# Altium schematic sheet GM-hv.SchDoc
size A
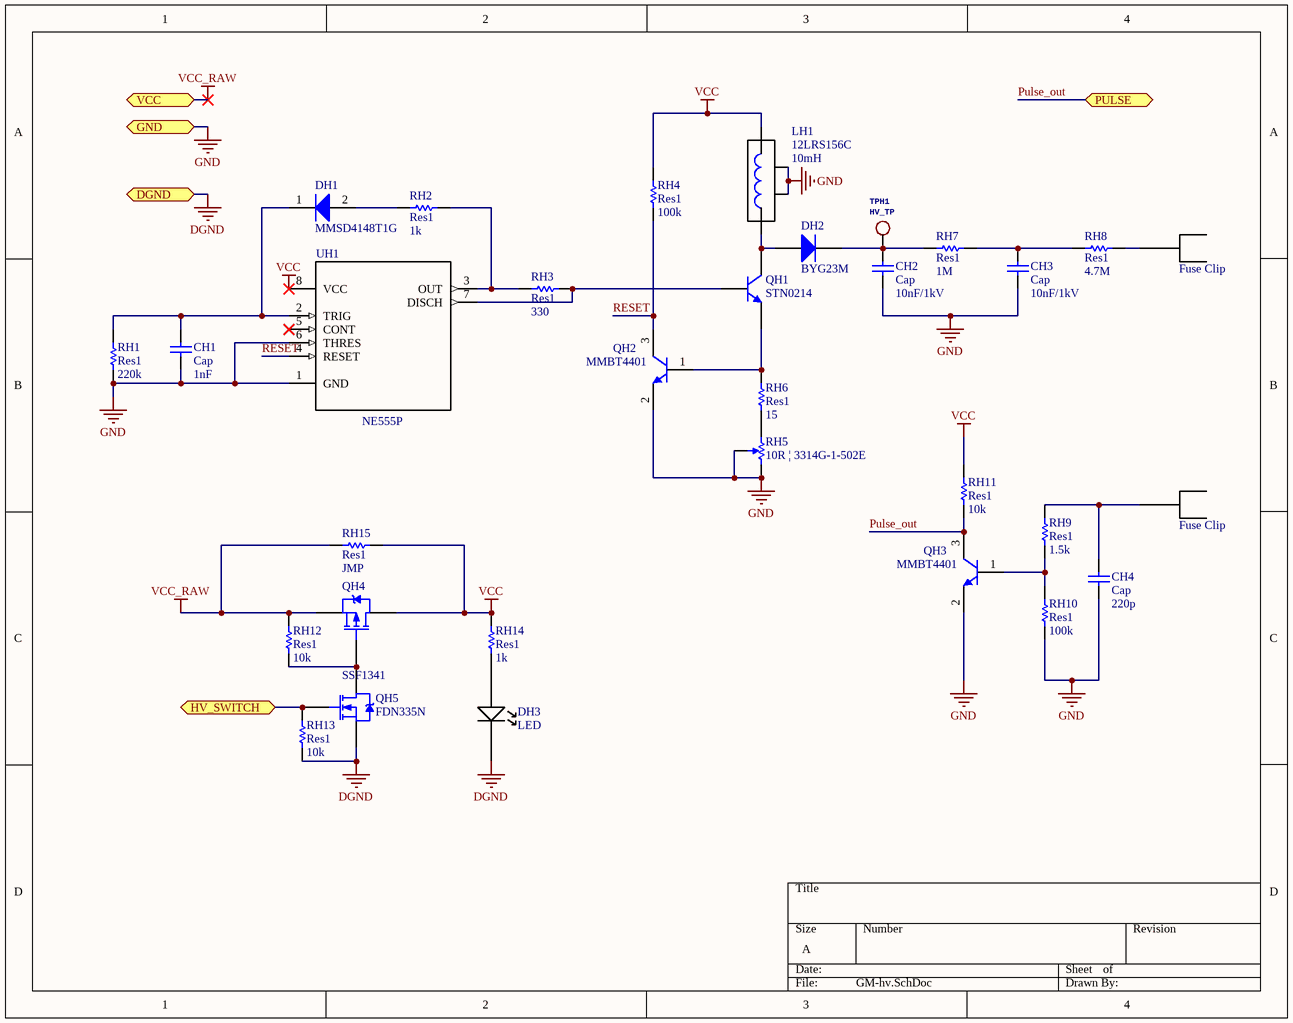
[diagram p0: GM-hv.SchDoc]

## Parts
CH1  Cap  value 1nF  [C 0603 / 1608]
CH2  Cap  value 10nF/1kV  [CAP1206R]
CH3  Cap  value 10nF/1kV  [CAP1206R]
CH4  Cap  value 220p  [C 0603 / 1608]
DH1  MMSD4148T1G  [ONSC-SOD-123-2-425-04_V]
DH2  BYG23M  [DO-214AC]
DH3  LED  [LED 0603]
JH1  Fuse Clip  [FUSE_BK-6003]
JH?  Fuse Clip  [FUSE_BK-6003]
LH1  12LRS156C  value 10mH  [IND_12LRS156C]
QH1  STN0214  [SOT-223-3 - NPN]
QH2  MMBT4401  [ONSC-SOT-23-3-318-08_M]
QH3  MMBT4401  [ONSC-SOT-23-3-318-08_M]
QH4  SSF1341  [SOT23]
QH5  FDN335N  [SOT23]
RH1  Res1  value 220k  [RES0603R]
RH2  Res1  value 1k  [RES0603R]
RH3  Res1  value 330  [RES0603R]
RH4  Res1  value 100k  [RES0603R]
RH5  10R | 3314G-1-502E  [BOUR-3314G-1_V]
RH6  Res1  value 15  [RES0603R]
RH7  Res1  value 1M  [RES0805R]
RH8  Res1  value 4.7M  [RES0805R]
RH9  Res1  value 1.5k  [RES0603R]
RH10  Res1  value 100k  [RES0603R]
RH11  Res1  value 10k  [RES0603R]
RH12  Res1  value 10k  [RES0603R]
RH13  Res1  value 10k  [RES0603R]
RH14  Res1  value 1k  [RES0603R]
RH15  Res1  value JMP  [RES0603R]
TPH1  HV_TP  [TESTPOINT_SMT]
UH1  NE555P  [SOIC-8]

## Ports
DGND (bidir), GND (bidir), HV_SWITCH (bidir), PULSE (bidir), VCC (bidir)

## Nets
DGND: DH3.2(-) QH5.2(S) RH13.1 ; port DGND
GND: CH1.1 CH2.1 CH3.1 CH4.1 LH1.2(GND) LH1.4(GND) QH2.2(E) QH3.2(E) RH1.1 RH5.2 RH5.3 RH10.1 UH1.1(GND) UH1.6(THRES) ; port GND
VCC: LH1.3 QH4.3(D) RH4.2 RH11.2 RH14.2 RH15.1 UH1.8(VCC)
VCC_RAW: QH4.2(S) RH12.2 RH15.2 ; port VCC
HV_SWITCH: QH5.1(G) RH13.2 ; port HV_SWITCH
Pulse_out: QH3.3(C) RH11.1 ; port PULSE
RESET: QH2.3(C) RH4.1 UH1.4(RESET)
NetCH1_2: CH1.2 DH1.1(K) RH1.2 UH1.2(TRIG)
NetCH2_2: CH2.2 DH2.2(K) RH7.1 TPH1.P$1
NetCH3_2: CH3.2 RH7.2 RH8.1
NetCH4_2: CH4.2 JH?.1(PIN) RH9.2
NetDH1_2: DH1.2(A) RH2.1
NetDH2_1: DH2.1(A) LH1.1 QH1.1(C)
NetDH3_1: DH3.1(+) RH14.1
NetJH1_1: JH1.1(PIN) RH8.2
NetQH1_2: QH1.2(B) RH3.2 UH1.7(DISCH)
NetQH1_3: QH1.3(E) QH2.1(B) RH6.2
NetQH3_1: QH3.1(B) RH9.1 RH10.2
NetQH4_1: QH4.1(G) QH5.3(D) RH12.1
NetRH2_2: RH2.2 RH3.1 UH1.3(OUT)
NetRH5_1: RH5.1 RH6.1

Not connected (* = marked no-connect by the designer): UH1 5(CONT)*

## Library data of the parts
CH1-CH4 = Cap: Capacitor; Published: 8-Jun-2000; LatestRevisionDate: 17-Jul-2002; LatestRevisionNote: Re-released for DXP Platform.; PackageReference: RAD-0.3; Publisher: Altium Limited; PackageDescription: Radial Cap, Thru-Hole; 2 Leads; 0.3 in Pin Spacing
DH1 = CMP-0895-00001-2: Switching Diode, 2-Pin SOD-123, Pb-Free, Tape and Reel; Manufacturer: On Semiconductor; trr Max (ns): 4; IF Max (A): 0.2; Configuration: Single; Mounting Technology: Surface Mount; ComponentLink2URL: http://www.onsemi.com/pub_link/Collateral/MMSD4148T1-D.PDF; ComponentLink1Description: Manufacturer URL; ComponentLink1URL: http://www.onsemi.com/; PartNumber: MMSD4148T1G; ComponentLink2Description: Datasheet; PackageDescription: 2-Pin SOD, Body 1.6 x 2.69 mm; Packing: Tape and Reel; DatasheetVersion: Rev. 11; PackageReference: SOD-123-2-425-04; ComponentLink3Description: Package Specification; ComponentLink3URL: http://www.onsemi.com/pub_link/Collateral/425-04.PDF; PackageVersion: Rev. G, 10/2009; RoHS: TRUE
DH2 = Diode: Default Diode; Published: 8-Jun-2000; LatestRevisionDate: 17-Jul-2002; LatestRevisionNote: Re-released for DXP Platform.; PackageVersion: Sep-1996; PackageReference: SMC; Publisher: Altium Limited; PackageDescription: DO-214-AB/SMC; 2 C-Bend Leads; Body 7.9 x 5.9 mm, inc. leads (LxW); Code_JEDEC: DO-214-AB
LH1 = Inductor_Shielded: Inductor; Code_IEC: 1005; Published: 8-Jun-2000; LatestRevisionDate: 29-May-2009; LatestRevisionNote: IPC-7351 Footprint Added.; PackageReference: 0402-A; Publisher: Altium Limited; PackageDescription: Chip Inductor; Code_JEITA: 0402
QH1 = NPN: NPN Bipolar Transistor; Published: 8-Jun-2000; LatestRevisionDate: 17-Jul-2002; LatestRevisionNote: Re-released for DXP Platform.; PackageReference: TO-226-AA; Publisher: Altium Limited; PackageDescription: TO, Flat Index; 3 In-Line, Axial Leads; Body Dia. 4.8mm; Leads 0.55 x 0.51 mm (max); Code_JEDEC: TO-226-AA
QH2 QH3 = CMP-0722-00001-1: General Purpose Transistor, NPN, 0.6 A IC Continuous, 3-Pin SOT23, RoHS, Tape and Reel; Manufacturer: ON Semiconductor; PartNumber: MMBT2222LT1G; PTM Max.: 0.225 W; HFE Max.: 300; HFE Min.: 100; V(BR) CEO: 30 V Min.; FT: 250 MHz; IC Continuous: 0.6 A; RoHS: TRUE; DatasheetVersion: Rev. 10; PackageVersion: Rev. AP; Polarity: NPN; PackageReference: SOT-23-3; PackageDescription: 3-Pin SOT23, Body 2.9 x 1.3 mm, Pitch 0.95 mm; ComponentLink1URL: http://www.onsemi.com/; ComponentLink2URL: http://www.onsemi.com/pub_link/Collateral/MMBT2222LT1-D.PDF; ComponentLink3URL: http://www.onsemi.com/pub_link/Collateral/MMBT2222LT1-D.PDF; Mounting Technology: Surface Mount; ComponentLink3Description: Package Specification; ComponentLink1Description: Manufacturer URL; Packing: Tape and Reel; ComponentLink2Description: Datasheet
QH4 = PMOS: P-Channel Power MOSFET PMV65XP; Part Number: 1758119; Package: SOT23; Supplier: Farnell; ComponentLink1Description: Datasheet; ComponentLink1URL: http://www.farnell.com/datasheets/1719226.pdf
QH5 = NMOS: N-Channel Power MOSFET PMV30UN; Part Number: 2469652; Package: SOT23; Supplier: Farnell; ComponentLink1Description: Datasheet; ComponentLink1URL: http://www.farnell.com/datasheets/1885685.pdf
RH1-RH4 RH6-RH15 = Res1: Resistor; Published: 8-Jun-2000; LatestRevisionDate: 17-Jul-2002; LatestRevisionNote: Re-released for DXP Platform.; PackageReference: AXIAL-0.3; Publisher: Altium Limited; PackageDescription: Axial Device, Thru-Hole; 2 Leads; 0.3 in Pin Spacing
RH5 = CMP-2000-05589-1: 4 mm Square Trimpot(R) Trimming Potentiometer, 5 KOhm, +/- 20%, 0.25 W, -55 to 125 degC, 3-Pin SMD, RoHS, Tape and Reel; Manufacturer: Bourns; Power: 250; Angle of rotation: 240°; Dielectric strength: 500; Resistance: 5; Curve: linear; Package Description: 3-Pin Surface Mount Device, Body 4.5 x 4.5 mm, Pitch 1.15 mm; Package Reference: 3314G-1; Mounting Technology: SurfaceMount; Datasheet URL: http://www.bourns.com/docs/Product-Datasheets/3314.pdf; Datasheet Version: 05/2016; Tolerance: ±20%; Manufacturer URL: http://www.bourns.com/; Temperature range: -55...+125°C; Package: GullWing
TPH1 = TESTPOINT
UH1 = NE555P: MF: Texas Instruments; Price: None; Package: PDIP-8 STMicroelectronics; SnapEDA_Link: https://www.snapeda.com/parts/NE555P/Texas%20Instruments/view-part/?ref=snap; Availability: Unavailable; MP: NE555P; Value: *